# Altium project Alt_BRD_UPS_3_3V.PrjPcb
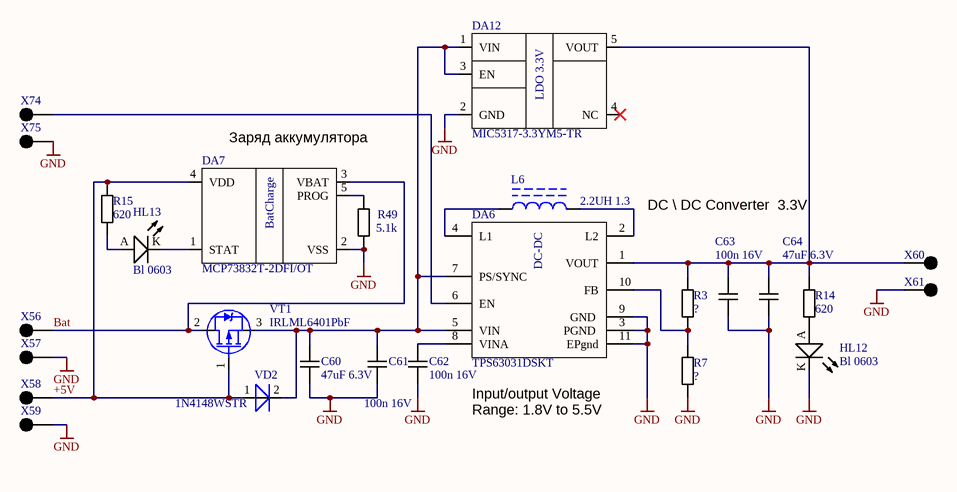
[diagram p0: Alt_BRD_UPS_3_3V.SchDoc]
1 sheet, 26 parts. Net scope: global (net labels, ports and power ports of the same name join across sheets).
Board file: Alt_BRD_UPS_3_3V.PcbDoc

## Sheet Alt_BRD_UPS_3_3V.SchDoc
size A4; SheetNumber: 1; SheetTotal: 1

### Parts
C60  47uF 6.3V  [CapKemet1005(0402)]
C61  100n 16V  [CapKemet1005(0402)]
C62  100n 16V  [CapKemet1005(0402)]
C63  100n 16V  [CapKemet1005(0402)]
C64  47uF 6.3V  [CapKemet1005(0402)]
DA6  TPS63031DSKT  [WSON-10]
DA7  MCP73832T-2DFI/OT  [SOT-23-5]
DA12  MIC5317-3.3YM5-TR  [SOT-23-OT5_N]
HL12  Bl 0603  [LED-0603-BLUE]
HL13  Bl 0603  [LED-0603-BLUE]
L6  2.2UH 1.3  [CDRH2D11]
R3  ?  [REZKemet 0402]
R7  ?  [REZKemet 0402]
R14  620  [REZKemet 0402]
R15  620  [REZKemet 0402]
R49  5.1k  [REZKemet 0402]
VD2  1N4148WSTR  [SOD323]
VT1  IRLML6401PbF  [SOT23-3N]
X56  PLLS1.27-1-R  [PLLS1.27-1-R]  (value not drawn)
X57  PLLS1.27-1-R  [PLLS1.27-1-R]  (value not drawn)
X58  PLLS1.27-1-R  [PLLS1.27-1-R]  (value not drawn)
X59  PLLS1.27-1-R  [PLLS1.27-1-R]  (value not drawn)
X60  PLLS1.27-1-R  [PLLS1.27-1-R]  (value not drawn)
X61  PLLS1.27-1-R  [PLLS1.27-1-R]  (value not drawn)
X74  PLLS1.27-1-R  [PLLS1.27-1-R]  (value not drawn)
X75  PLLS1.27-1-R  [PLLS1.27-1-R]  (value not drawn)

### Nets
GND: C60.1 C61.1 C62.1 C63.1 C64.1 DA6.3(PGND) DA6.9(GND) DA6.11(EPgnd) DA7.2(VSS) DA12.2(GND) HL12.K R7.1 R49.2 X57.1 X59.1 X61.1 X75.1
+5V: DA7.4(VDD) R15.2 VD2.1 VT1.1(G) X58.1
Bat: DA7.3(VBAT) VT1.2(D) X56.1
NetC60_2: C60.2 C61.2 DA6.5(VIN) DA6.7(PS/SYNC) DA12.1(VIN) DA12.3(EN) VD2.2 VT1.3(S)
NetC62_2: C62.2 DA6.8(VINA)
NetC63_2: C63.2 C64.2 DA6.1(VOUT) DA12.5(VOUT) R3.2 R14.2 X60.1
NetDA6_2: DA6.2(L2) L6.1
NetDA6_4: DA6.4(L1) L6.2
NetDA6_6: DA6.6(EN) X74.1
NetDA6_10: DA6.10(FB) R3.1 R7.2
NetDA7_1: DA7.1(STAT) HL13.K
NetDA7_5: DA7.5(PROG) R49.1
NetHL12_A: HL12.A R14.1
NetHL13_A: HL13.A R15.1

Not connected (* = marked no-connect by the designer): DA12 4(NC)*

### Notes on the sheet
- (near DA7) Заряд аккумулятора
- DC \ DC Converter  3.3V
- PSM=0-ON
- Input/output Voltage Range: 1.8V to 5.5V
- (in symbol MCP73832T-2DFI/OT) BatCharge
- (in symbol MIC5317-3.3YM5-TR) LDO 3.3V
- (in symbol TPS63031DSKT) DC-DC

### Library data of the parts
C60 C64 = GRM188R60J476ME15D: CAP CER 47UF 6.3V X5R 0603; Part Number: GRM188R60J476ME15D; HelpURL: https://www.digikey.com/en/products/detail/murata-electronics/GRM188R60J476ME15D/5877410; Digi-Key Part Number: 490-13247-1-ND; Price$: 0.16924; Manufacturer Part Number: GRM188R60J476ME15D; Package: 0603
C61-C63 = CL05F104ZO5NNNC: Cap Cer 0.1uF 16V 1% C0G(NP0) MLCC; Part Number: CL05F104ZO5NNNC; HelpURL: https://www.digikey.com/product-detail/en/CL05F104ZO5NNNC/1276-1004-1-ND/3889090/?itemSeq=332907103; Digi-Key Part Number: 1276-1004-1-ND; Price$: 0.00475; Manufacturer Part Number: CL05F104ZO5NNNC; Package: 0402
DA6 = TPS63031DSKT: IC REG BCK BST 3.3V 900MA 10SON; Part Number: TPS63031DSKT; HelpURL: https://www.digikey.com/en/products/detail/texas-instruments/TPS63031DSKT/1967863; Price$: 2,28; Digi-Key Part Number: 296-23904-1-ND; Manufacturer Part Number: TPS63031DSKT
DA7 = MCP73832T-2DFI/OT: IC LI-ION/LI-POLY CTRLR SOT23-5; Part Number: MCP73832T-2DFI/OT; HelpURL: https://www.digikey.com/product-detail/en/MCP73832T-2DFI%2fOT/MCP73832T-2DFI%2fOTCT-ND/2060344/?itemSeq=274027917; Digi-Key Part Number: MCP73832T-2DFI/OTCT-ND
DA12 = MIC5317-3.3YM5-TR: Linear Voltage Regulator IC 1 Output 150mA SOT-23-5; Part Number: MIC5317-3.3YM5-TR; HelpURL: https://www.digikey.com/product-detail/en/microchip-technology/MIC5317-3.3YM5-TR/MIC5317-3.3YM5-CT-ND/7671939; Price$: 0,16; Digi-Key Part Number: MIC5317-3.3YM5-CT-ND; Manufacturer Part Number: MIC5317-3.3YM5-TR
HL12 HL13 = 150060BS55040: LED BLUE DIFFUSED 0603 SMD; Part Number: 150060BS55040; HelpURL: https://www.digikey.com/products/en?keywords=732-12013-1-ND; Digi-Key Part Number: 732-12013-1-ND; Manufacturer Part Number: 150060BS55040; Package: 0603
L6 = CDRH2D11/HPNP-2R2NC: FIXED IND 2.2UH 1.3A 120 MOHM; Published: 24-Mar-1999; LatestRevisionDate: 17-Jul-2002; LatestRevisionNote: Re-released for DXP Platform.; PackageReference: AXIAL-0.9; Publisher: Altium Limited; PackageDescription: Axial Device, Thru-Hole; 2 Leads; 0.9 in Pin Spacing; Part Number: CDRH2D11/HPNP-2R2NC; HelpURL: https://www.digikey.com/product-detail/en/sumida-america-components-inc/CDRH2D11-HPNP-2R2NC/308-1578-1-ND/2620850; Price$: 0.69; Digi-Key Part Number: 308-1578-1-ND; Manufacturer Part Number: CDRH2D11/HPNP-2R2NC
R3 R7 R14 R15 = RESC1005(0402): Part Number: RESC1005(0402); Package: 0402
R49 = RESC1005(0402): RES SMD 5.1K OHM 1% 1/10W 0402; Manufacturer Part Number: ERJ-2RKF5101X; Part Number: RESC1005(0402); HelpURL: https://eu.mouser.com/ProductDetail/ROHM-Semiconductor/SFR01MZPF5101?qs=sGAEpiMZZMvdGkrng054t7z4BkURc4Lz8VVRSaz2ejIiXEQeYNXBXw%3D%3D; Price$: 0.1; Package: 0402; Mouser Part Number: 755-SFR01MZPF5101
VD2 = 1N4148WSTR: DIODE GEN PURP 75V 300MA SOD323; Published: 8-Jun-2000; LatestRevisionDate: 17-Jul-2002; LatestRevisionNote: Re-released for DXP Platform.; DatasheetVersion: 1997; PackageReference: DO-35; Publisher: Altium Limited; PackageDescription: Diode, Axial; Body 3.8 x 1.9 mm (LxDia. max), Lead Dia. 0.53 mm (max); Code_JEDEC: DO-204-AH; ComponentLink1Description: Manufacturer Link; ComponentLink1URL: http://www.fairchildsemi.com/; ComponentLink2Description: Datasheet; ComponentLink2URL: http://www.fairchildsemi.com/ds/1N%2F1N4148.pdf; Part Number: 1N4148WSTR; HelpURL: https://www.digikey.com/product-detail/en/smc-diode-solutions/1N4148WSTR/1655-1359-1-ND/6022804; Digi-Key Part Number: 1655-1359-1-ND; Price$: ?; Note: ?; Manufacturer Part Number: ?; Package: ?
VT1 = IRLML6401PbF: Note: ???; Part Number: IRLML6401PbF; HelpURL: https://www.infineon.com/dgdl/irlml6401pbf.pdf?fileId=5546d462533600a401535668b96d2634; Digi-Key Part Number: ???; Price$: ???; Manufacturer Part Number: ???; Package: ???
X56-X61 X74 X75 = PLLS1.27-1-R: Part Number: PLLS1.27-1-R